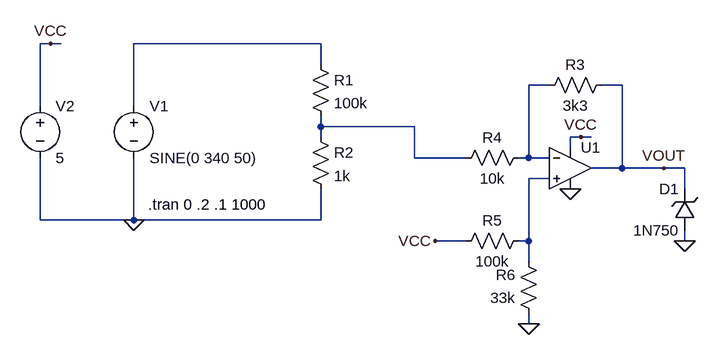
[diagram p0: schematic VoltageSensor.asc]
VoltageSensor.asc, the LTspice schematic file:
Version 4
SHEET 1 880 680
WIRE -352 -16 -368 -16
WIRE -336 -16 -352 -16
WIRE 64 -16 -224 -16
WIRE 64 16 64 -16
WIRE 416 48 384 48
WIRE 528 48 496 48
WIRE -368 80 -368 -16
WIRE -224 80 -224 -16
WIRE 64 112 64 96
WIRE 208 112 64 112
WIRE 64 128 64 112
WIRE 464 128 448 128
WIRE 480 128 464 128
WIRE 448 144 448 128
WIRE 208 160 208 112
WIRE 288 160 208 160
WIRE 384 160 384 48
WIRE 384 160 368 160
WIRE 416 160 384 160
WIRE 528 176 528 48
WIRE 528 176 480 176
WIRE 592 176 528 176
WIRE 624 176 592 176
WIRE 416 192 384 192
WIRE 624 208 624 176
WIRE -368 256 -368 160
WIRE -224 256 -224 160
WIRE -224 256 -368 256
WIRE 64 256 64 208
WIRE 64 256 -224 256
WIRE 288 288 240 288
WIRE 384 288 384 192
WIRE 384 288 368 288
WIRE 624 288 624 272
WIRE 384 320 384 288
WIRE 384 416 384 400
FLAG -224 256 0
FLAG -352 -16 VCC
FLAG 448 208 0
FLAG 240 288 VCC
FLAG 464 128 VCC
FLAG 384 416 0
FLAG 624 288 0
FLAG 592 176 VOUT
SYMBOL voltage -224 64 R0
WINDOW 123 0 0 Left 0
WINDOW 39 0 0 Left 0
SYMATTR InstName V1
SYMATTR Value SINE(0 340 50)
SYMBOL res 48 0 R0
SYMATTR InstName R1
SYMATTR Value 100k
SYMBOL res 48 112 R0
SYMATTR InstName R2
SYMATTR Value 1k
SYMBOL zener 640 272 R180
WINDOW 0 24 64 Left 2
WINDOW 3 24 0 Left 2
SYMATTR InstName D1
SYMATTR Value 1N750
SYMBOL OpAmps\\UniversalOpAmp1 448 176 R0
SYMATTR InstName U1
SYMBOL voltage -368 64 R0
WINDOW 123 0 0 Left 0
WINDOW 39 0 0 Left 0
SYMATTR InstName V2
SYMATTR Value 5
SYMBOL res 512 32 R90
WINDOW 0 0 56 VBottom 2
WINDOW 3 32 56 VTop 2
SYMATTR InstName R3
SYMATTR Value 3k3
SYMBOL res 384 144 R90
WINDOW 0 0 56 VBottom 2
WINDOW 3 32 56 VTop 2
SYMATTR InstName R4
SYMATTR Value 10k
SYMBOL res 384 272 R90
WINDOW 0 0 56 VBottom 2
WINDOW 3 32 56 VTop 2
SYMATTR InstName R5
SYMATTR Value 100k
SYMBOL res 400 416 R180
WINDOW 0 36 76 Left 2
WINDOW 3 36 40 Left 2
SYMATTR InstName R6
SYMATTR Value 33k
TEXT -202 232 Left 2 !.tran 0 .2 .1 1000

The netlist it stands for:
* VoltageSensor.asc
V1 N001 0 SINE(0 340 50)
R1 N001 N003 100k
R2 N003 0 1k
D1 0 VOUT 1N750
XU1 N004 N002 VCC 0 VOUT level1 Avol=1Meg GBW=10Meg Vos=0 En=0 Enk=0 In=0 Ink=0 Rin=500Meg  ; pins In+ In- V+ V- OUT
V2 VCC 0 5
R3 VOUT N002 3k3
R4 N002 N003 10k
R5 N004 VCC 100k
R6 0 N004 33k
.model D D
.lib standard.dio
.tran 0 .2 .1 1000
.lib UniversalOpAmp1.lib
.backanno
.end